# EAGLE design lamloei_app_a092508 (EAGLE 7.7.0)
CNAME: LamLoei A092508; CREVISION: R1; DESIGNER: lamloei co.,ltd.
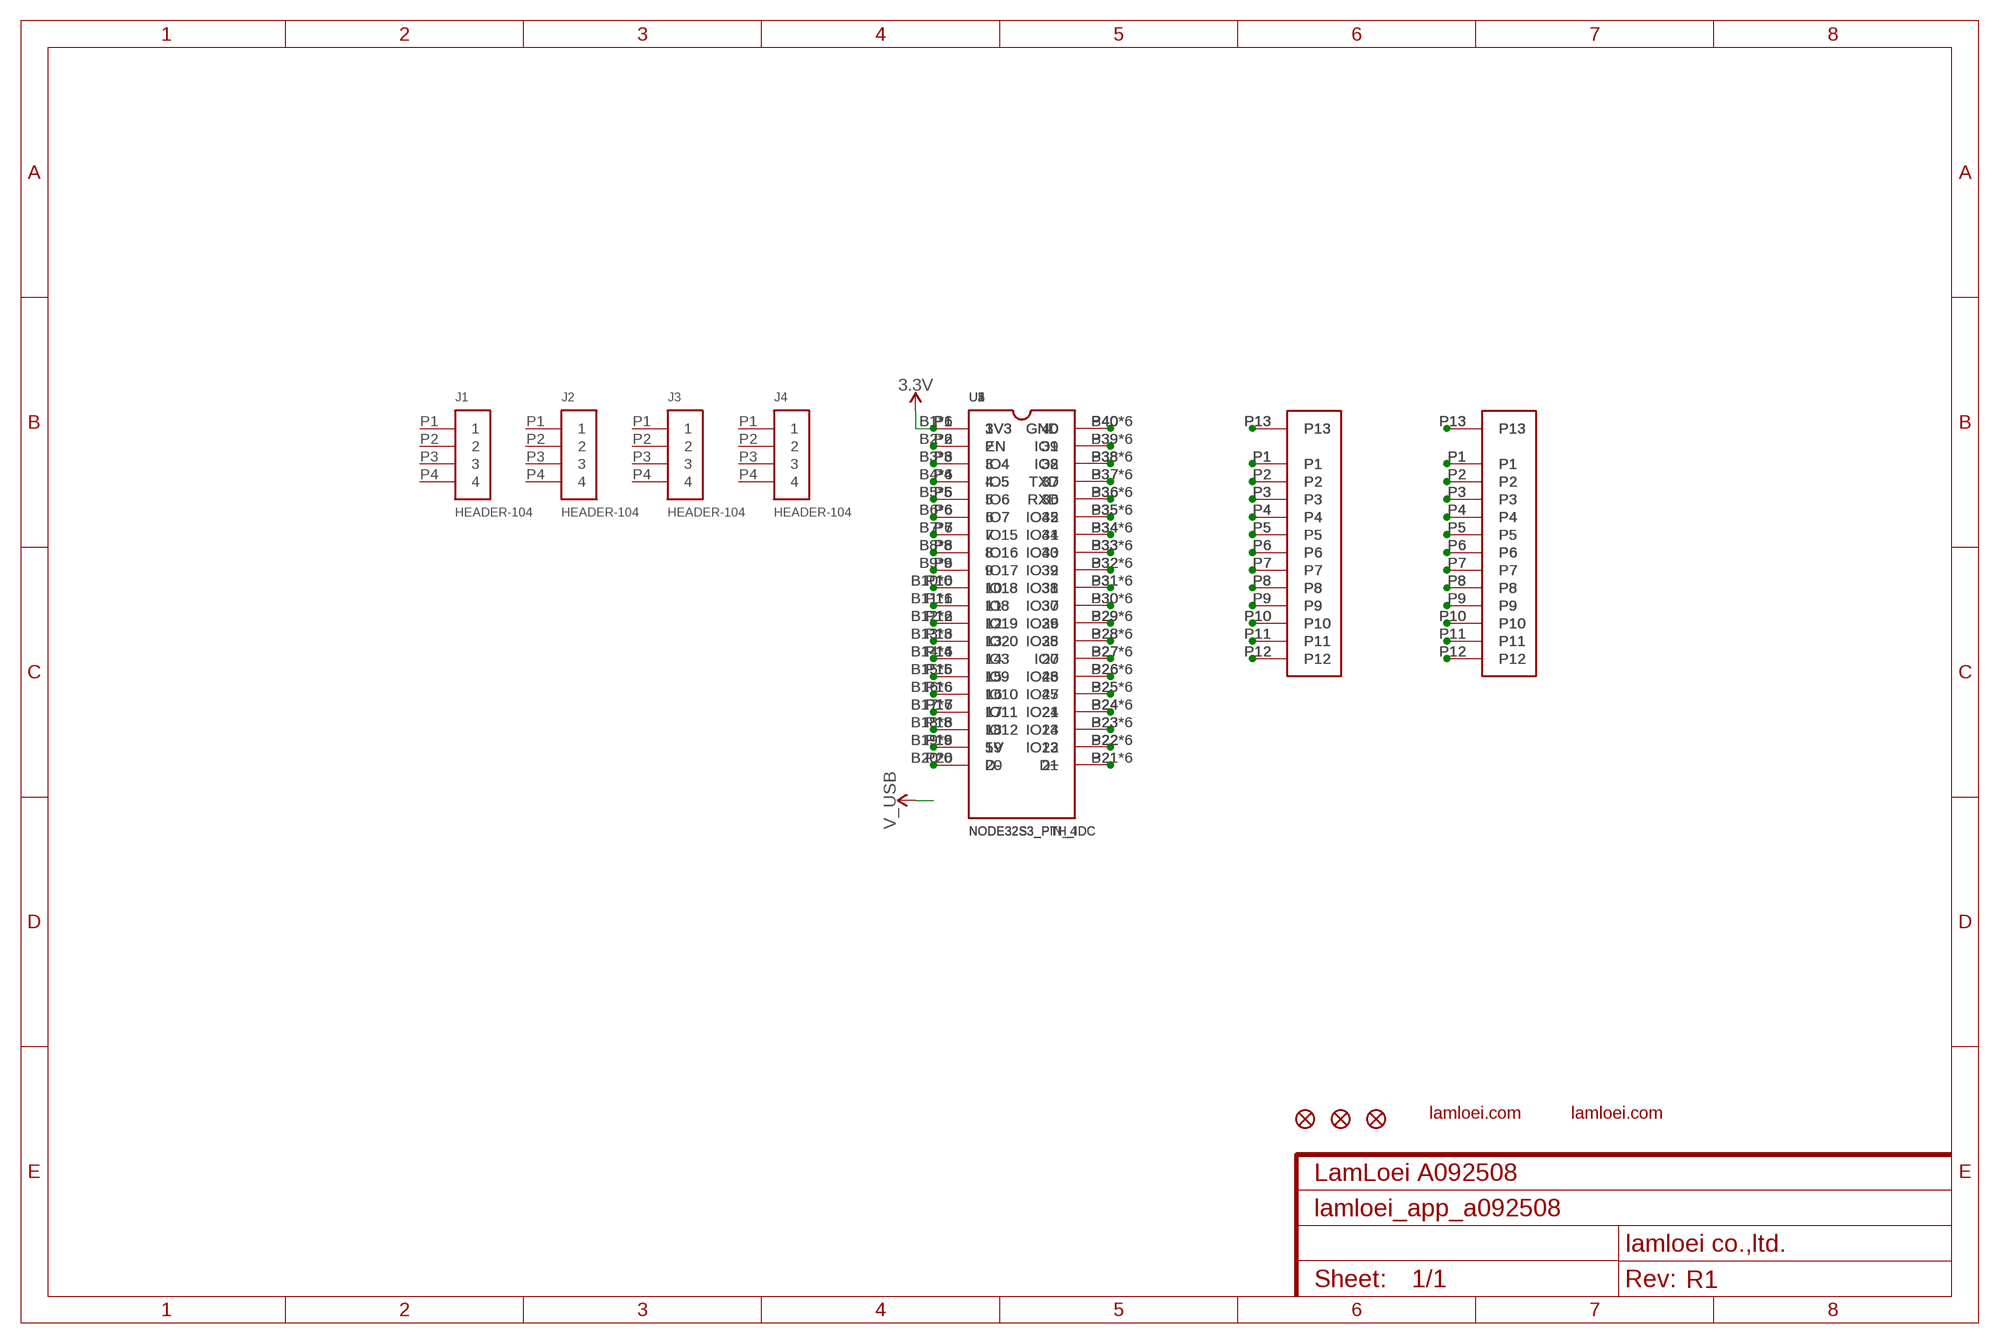
[diagram p0: schematic, sheet 1]

## Parts
J1  HEADER-104  [HEADER-104]
J2  HEADER-104  [HEADER-104]
J3  HEADER-104  [HEADER-104]
J4  HEADER-104  [HEADER-104]
U1  NODE32S3_PIN_4  [NODE32S3_PTH_4]
U2  NODE32S3_PIN_4  [NODE32S3_PTH_4]
U3  NODE32S3_PTH_IDC  [NODE32S3_PTH_IDC]
U4  NODE32S3_PTH_IDC  [NODE32S3_PTH_IDC]
U5  NODE32S3_PTH_IDC  [NODE32S3_PTH_IDC]
X1  5EHDRC-12P-508  [5EHDRC-12P-508]
X2  5EHDRC-12P-5.08MM  [5EHDRC-12P-5.08MM]
X3  5EHDRC-12P-2-508  [5EHDRC-12P-2-508]
X4  5EHDRC-12P-508  [5EHDRC-12P-508]
X5  5EHDRC-12P-5.08MM  [5EHDRC-12P-5.08MM]
X6  5EHDRC-12P-2-508  [5EHDRC-12P-2-508]
ZFD1  FIDUCIAL1X2  [FIDUCIAL-1X2]
ZFD2  FIDUCIAL1X2  [FIDUCIAL-1X2]
ZFD3  FIDUCIAL1X2  [FIDUCIAL-1X2]
ZL1  LAMLEOI_LOGO_3  [LAMLEOI_LOGO_3]
ZL2  LAMLEOI_LOGO_3  [LAMLEOI_LOGO_3]

## Nets
3.3V: U1.B1 U1.N1 U1.O1 U1.P1 U1.Q1 U1.T1 U2.B1 U2.N1 U2.O1 U2.P1 U2.Q1 U2.T1 U3.P1(3V3) U4.P1(3V3) U5.P1(3V3)
N$2: X1.P1 X2.P1 X3.P1
N$3: U1.B2 U1.N2 U1.O2 U1.P2 U1.Q2 U1.T2 U2.B2 U2.N2 U2.O2 U2.P2 U2.Q2 U2.T2 U3.P2(EN) U4.P2(EN) U5.P2(EN)
N$4: U1.B3 U1.N3 U1.O3 U1.P3 U1.Q3 U1.T3 U2.B3 U2.N3 U2.O3 U2.P3 U2.Q3 U2.T3 U3.P3(IO4) U4.P3(IO4) U5.P3(IO4)
N$5: U1.B4 U1.N4 U1.O4 U1.P4 U1.Q4 U1.T4 U2.B4 U2.N4 U2.O4 U2.P4 U2.Q4 U2.T4 U3.P4(IO5) U4.P4(IO5) U5.P4(IO5)
N$6: U1.B5 U1.N5 U1.O5 U1.P5 U1.Q5 U1.T5 U2.B5 U2.N5 U2.O5 U2.P5 U2.Q5 U2.T5 U3.P5(IO6) U4.P5(IO6) U5.P5(IO6)
N$7: U1.B6 U1.N6 U1.O6 U1.P6 U1.Q6 U1.T6 U2.B6 U2.N6 U2.O6 U2.P6 U2.Q6 U2.T6 U3.P6(IO7) U4.P6(IO7) U5.P6(IO7)
N$8: U1.B7 U1.N7 U1.O7 U1.P7 U1.Q7 U1.T7 U2.B7 U2.N7 U2.O7 U2.P7 U2.Q7 U2.T7 U3.P7(IO15) U4.P7(IO15) U5.P7(IO15)
N$9: U1.B8 U1.N8 U1.O8 U1.P8 U1.Q8 U1.T8 U2.B8 U2.N8 U2.O8 U2.P8 U2.Q8 U2.T8 U3.P8(IO16) U4.P8(IO16) U5.P8(IO16)
N$10: U1.B9 U1.N9 U1.O9 U1.P9 U1.Q9 U1.T9 U2.B9 U2.N9 U2.O9 U2.P9 U2.Q9 U2.T9 U3.P9(IO17) U4.P9(IO17) U5.P9(IO17)
N$11: U1.B10 U1.N10 U1.O10 U1.P10 U1.Q10 U1.T10 U2.B10 U2.N10 U2.O10 U2.P10 U2.Q10 U2.T10 U3.P10(IO18) U4.P10(IO18) U5.P10(IO18)
N$12: U1.B11 U1.N11 U1.O11 U1.P11 U1.Q11 U1.T11 U2.B11 U2.N11 U2.O11 U2.P11 U2.Q11 U2.T11 U3.P11(IO8) U4.P11(IO8) U5.P11(IO8)
N$13: U1.B12 U1.N12 U1.O12 U1.P12 U1.Q12 U1.T12 U2.B12 U2.N12 U2.O12 U2.P12 U2.Q12 U2.T12 U3.P12(IO19) U4.P12(IO19) U5.P12(IO19)
N$14: U1.B13 U1.N13 U1.O13 U1.P13 U1.Q13 U1.T13 U2.B13 U2.N13 U2.O13 U2.P13 U2.Q13 U2.T13 U3.P13(IO20) U4.P13(IO20) U5.P13(IO20)
N$15: U1.B14 U1.N14 U1.O14 U1.P14 U1.Q14 U1.T14 U2.B14 U2.N14 U2.O14 U2.P14 U2.Q14 U2.T14 U3.P14(IO3) U4.P14(IO3) U5.P14(IO3)
N$16: U1.B15 U1.N15 U1.O15 U1.P15 U1.Q15 U1.T15 U2.B15 U2.N15 U2.O15 U2.P15 U2.Q15 U2.T15 U3.P15(IO9) U4.P15(IO9) U5.P15(IO9)
N$17: U1.B17 U1.N17 U1.O17 U1.P17 U1.Q17 U1.T17 U2.B17 U2.N17 U2.O17 U2.P17 U2.Q17 U2.T17 U3.P17(IO11) U4.P17(IO11) U5.P17(IO11)
N$18: U1.B16 U1.N16 U1.O16 U1.P16 U1.Q16 U1.T16 U2.B16 U2.N16 U2.O16 U2.P16 U2.Q16 U2.T16 U3.P16(IO10) U4.P16(IO10) U5.P16(IO10)
N$19: U1.B18 U1.N18 U1.O18 U1.P18 U1.Q18 U1.T18 U2.B18 U2.N18 U2.O18 U2.P18 U2.Q18 U2.T18 U3.P18(IO12) U4.P18(IO12) U5.P18(IO12)
N$20: U1.B19 U1.N19 U1.O19 U1.P19 U1.Q19 U1.T19 U2.B19 U2.N19 U2.O19 U2.P19 U2.Q19 U2.T19 U3.P19(5V) U4.P19(5V) U5.P19(5V)
N$21: U1.B20 U1.N20 U1.O20 U1.P20 U1.Q20 U1.T20 U2.B20 U2.N20 U2.O20 U2.P20 U2.Q20 U2.T20 U3.P20(D-) U4.P20(D-) U5.P20(D-)
N$22: U1.B21 U1.N21 U1.O21 U1.P21 U1.Q21 U1.T21 U2.B21 U2.N21 U2.O21 U2.P21 U2.Q21 U2.T21 U3.P21(D+) U4.P21(D+) U5.P21(D+)
N$23: U1.B22 U1.N22 U1.O22 U1.P22 U1.Q22 U1.T22 U2.B22 U2.N22 U2.O22 U2.P22 U2.Q22 U2.T22 U3.P22(IO13) U4.P22(IO13) U5.P22(IO13)
N$24: U1.B23 U1.N23 U1.O23 U1.P23 U1.Q23 U1.T23 U2.B23 U2.N23 U2.O23 U2.P23 U2.Q23 U2.T23 U3.P23(IO14) U4.P23(IO14) U5.P23(IO14)
N$25: U1.B24 U1.N24 U1.O24 U1.P24 U1.Q24 U1.T24 U2.B24 U2.N24 U2.O24 U2.P24 U2.Q24 U2.T24 U3.P24(IO21) U4.P24(IO21) U5.P24(IO21)
N$26: U1.B25 U1.N25 U1.O25 U1.P25 U1.Q25 U1.T25 U2.B25 U2.N25 U2.O25 U2.P25 U2.Q25 U2.T25 U3.P25(IO47) U4.P25(IO47) U5.P25(IO47)
N$27: U1.B26 U1.N26 U1.O26 U1.P26 U1.Q26 U1.T26 U2.B26 U2.N26 U2.O26 U2.P26 U2.Q26 U2.T26 U3.P26(IO48) U4.P26(IO48) U5.P26(IO48)
N$28: U1.B27 U1.N27 U1.O27 U1.P27 U1.Q27 U1.T27 U2.B27 U2.N27 U2.O27 U2.P27 U2.Q27 U2.T27 U3.P27(IO0) U4.P27(IO0) U5.P27(IO0)
N$29: U1.B28 U1.N28 U1.O28 U1.P28 U1.Q28 U1.T28 U2.B28 U2.N28 U2.O28 U2.P28 U2.Q28 U2.T28 U3.P28(IO35) U4.P28(IO35) U5.P28(IO35)
N$30: U1.B29 U1.N29 U1.O29 U1.P29 U1.Q29 U1.T29 U2.B29 U2.N29 U2.O29 U2.P29 U2.Q29 U2.T29 U3.P29(IO36) U4.P29(IO36) U5.P29(IO36)
N$31: U1.B30 U1.N30 U1.O30 U1.P30 U1.Q30 U1.T30 U2.B30 U2.N30 U2.O30 U2.P30 U2.Q30 U2.T30 U3.P30(IO37) U4.P30(IO37) U5.P30(IO37)
N$32: U1.B31 U1.N31 U1.O31 U1.P31 U1.Q31 U1.T31 U2.B31 U2.N31 U2.O31 U2.P31 U2.Q31 U2.T31 U3.P31(IO38) U4.P31(IO38) U5.P31(IO38)
N$33: U1.B32 U1.N32 U1.O32 U1.P32 U1.Q32 U1.T32 U2.B32 U2.N32 U2.O32 U2.P32 U2.Q32 U2.T32 U3.P32(IO39) U4.P32(IO39) U5.P32(IO39)
N$34: U1.B33 U1.N33 U1.O33 U1.P33 U1.Q33 U1.T33 U2.B33 U2.N33 U2.O33 U2.P33 U2.Q33 U2.T33 U3.P33(IO40) U4.P33(IO40) U5.P33(IO40)
N$35: U1.B34 U1.N34 U1.O34 U1.P34 U1.Q34 U1.T34 U2.B34 U2.N34 U2.O34 U2.P34 U2.Q34 U2.T34 U3.P34(IO41) U4.P34(IO41) U5.P34(IO41)
N$36: U1.B35 U1.N35 U1.O35 U1.P35 U1.Q35 U1.T35 U2.B35 U2.N35 U2.O35 U2.P35 U2.Q35 U2.T35 U3.P35(IO42) U4.P35(IO42) U5.P35(IO42)
N$37: U1.B36 U1.N36 U1.O36 U1.P36 U1.Q36 U1.T36 U2.B36 U2.N36 U2.O36 U2.P36 U2.Q36 U2.T36 U3.P36(RXD) U4.P36(RXD) U5.P36(RXD)
N$38: U1.B37 U1.N37 U1.O37 U1.P37 U1.Q37 U1.T37 U2.B37 U2.N37 U2.O37 U2.P37 U2.Q37 U2.T37 U3.P37(TXD) U4.P37(TXD) U5.P37(TXD)
N$39: U1.B38 U1.N38 U1.O38 U1.P38 U1.Q38 U1.T38 U2.B38 U2.N38 U2.O38 U2.P38 U2.Q38 U2.T38 U3.P38(IO2) U4.P38(IO2) U5.P38(IO2)
N$40: U1.B39 U1.N39 U1.O39 U1.P39 U1.Q39 U1.T39 U2.B39 U2.N39 U2.O39 U2.P39 U2.Q39 U2.T39 U3.P39(IO1) U4.P39(IO1) U5.P39(IO1)
N$41: U1.B40 U1.N40 U1.O40 U1.P40 U1.Q40 U1.T40 U2.B40 U2.N40 U2.O40 U2.P40 U2.Q40 U2.T40 U3.P40(GND) U4.P40(GND) U5.P40(GND)
N$42: X1.P2 X2.P2 X3.P2
N$43: X1.P3 X2.P3 X3.P3
N$44: X1.P4 X2.P4 X3.P4
N$45: X1.P5 X2.P5 X3.P5
N$46: X1.P6 X2.P6 X3.P6
N$47: X1.P7 X2.P7 X3.P7
N$48: X1.P8 X2.P8 X3.P8
N$49: X1.P9 X2.P9 X3.P9
N$50: X1.P10 X2.P10 X3.P10
N$51: X1.P11 X2.P11 X3.P11
N$52: X1.P12 X2.P12 X3.P12
N$53: X1.P13 X2.P13 X3.P13
N$54: X4.P1 X5.P1 X6.P1
N$55: X4.P2 X5.P2 X6.P2
N$56: X4.P3 X5.P3 X6.P3
N$57: X4.P4 X5.P4 X6.P4
N$58: X4.P5 X5.P5 X6.P5
N$59: X4.P6 X5.P6 X6.P6
N$60: X4.P7 X5.P7 X6.P7
N$61: X4.P8 X5.P8 X6.P8
N$62: X4.P9 X5.P9 X6.P9
N$63: X4.P10 X5.P10 X6.P10
N$64: X4.P11 X5.P11 X6.P11
N$65: X4.P12 X5.P12 X6.P12
N$66: X4.P13 X5.P13 X6.P13
Unconnected: J1.P1 J1.P2 J1.P3 J1.P4 J2.P1 J2.P2 J2.P3 J2.P4 J3.P1 J3.P2 J3.P3 J3.P4 J4.P1 J4.P2 J4.P3 J4.P4

## Library data of the parts
J1-J4 = lamloei_e77_HEADER-104A:HEADER-104
U1 U2 = lamloei_e77_node32s3:NODE32S3_PIN_4
U3-U5 = lamloei_e77_node32s3:NODE32S3_PTH_IDC
X1 X4 = lamloei_e77_5EHDRC-12P:5EHDRC-12P-508
X2 X5 = lamloei_e77_5EHDRC-12P:5EHDRC-12P-5.08MM
X3 X6 = lamloei_e77_5EHDRC-12P:5EHDRC-12P-2-508
ZFD1-ZFD3 = SparkFun-Aesthetics:FIDUCIAL: Fiducial Alignment Points Point-of-reference for pick-and-place machines and other optical instruments.
ZL1 ZL2 = lamloei_logo_3:LAMLEOI_LOGO_3: lamloei

## Board
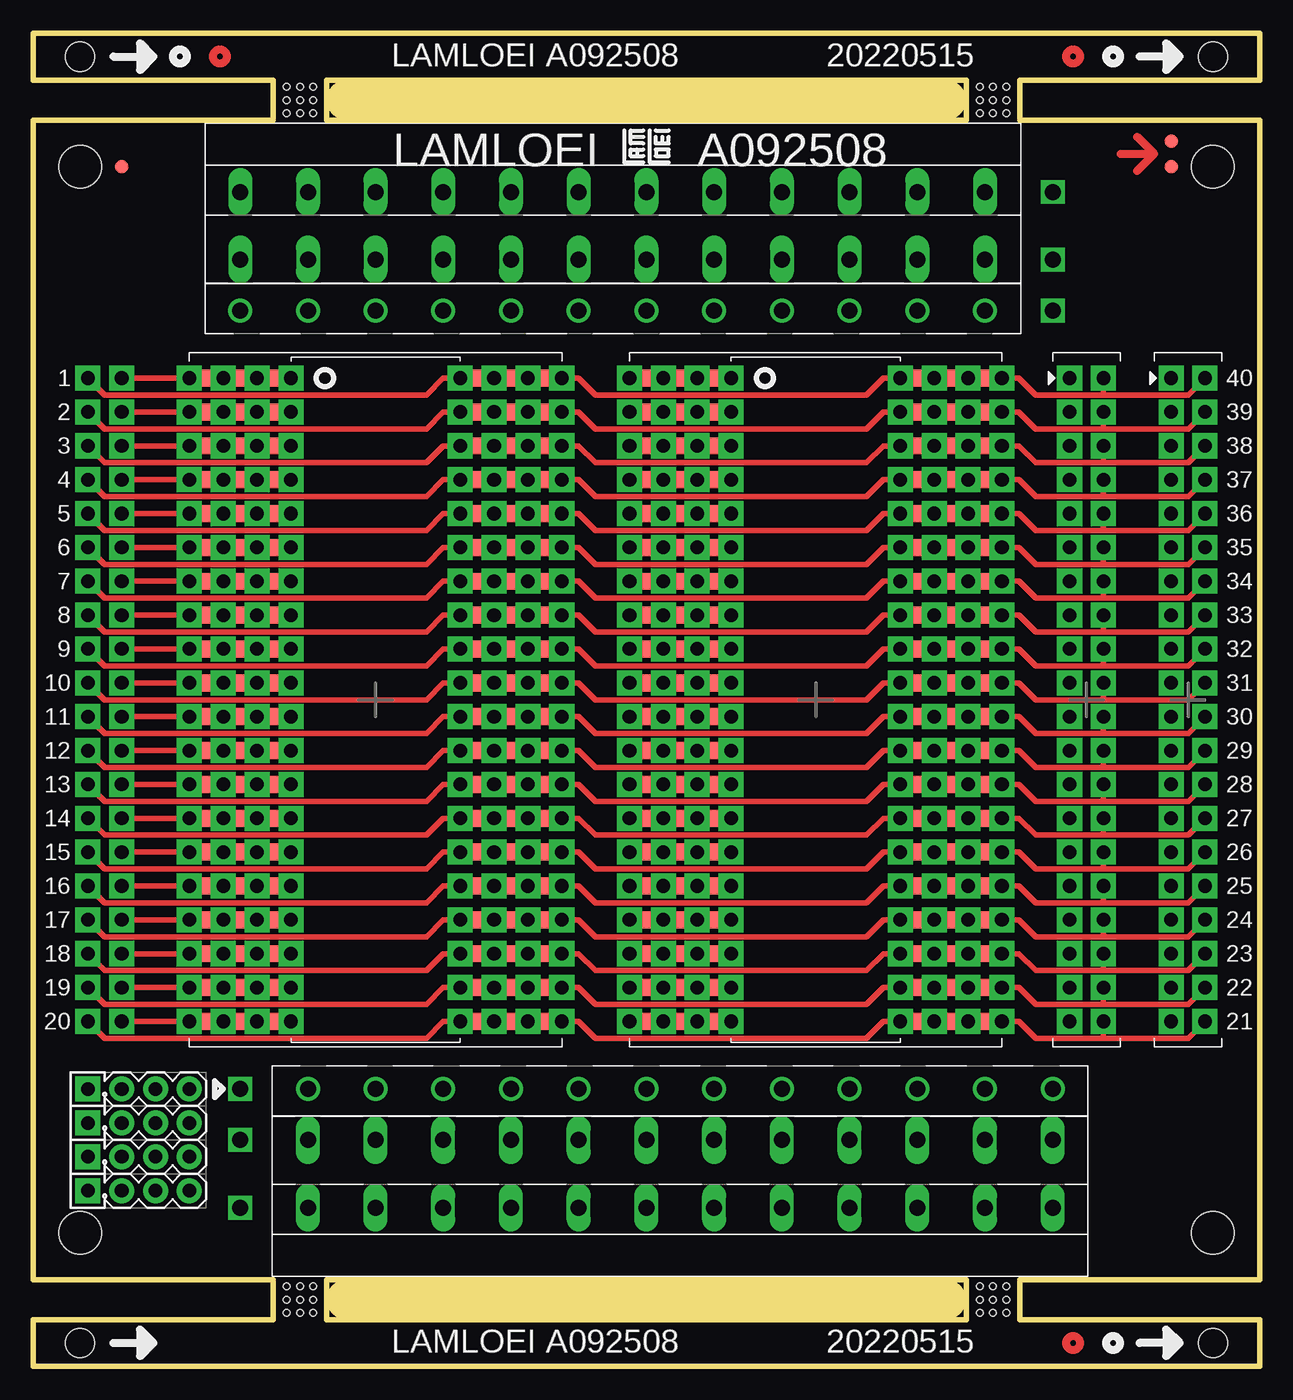
[diagram p1: board, top side]
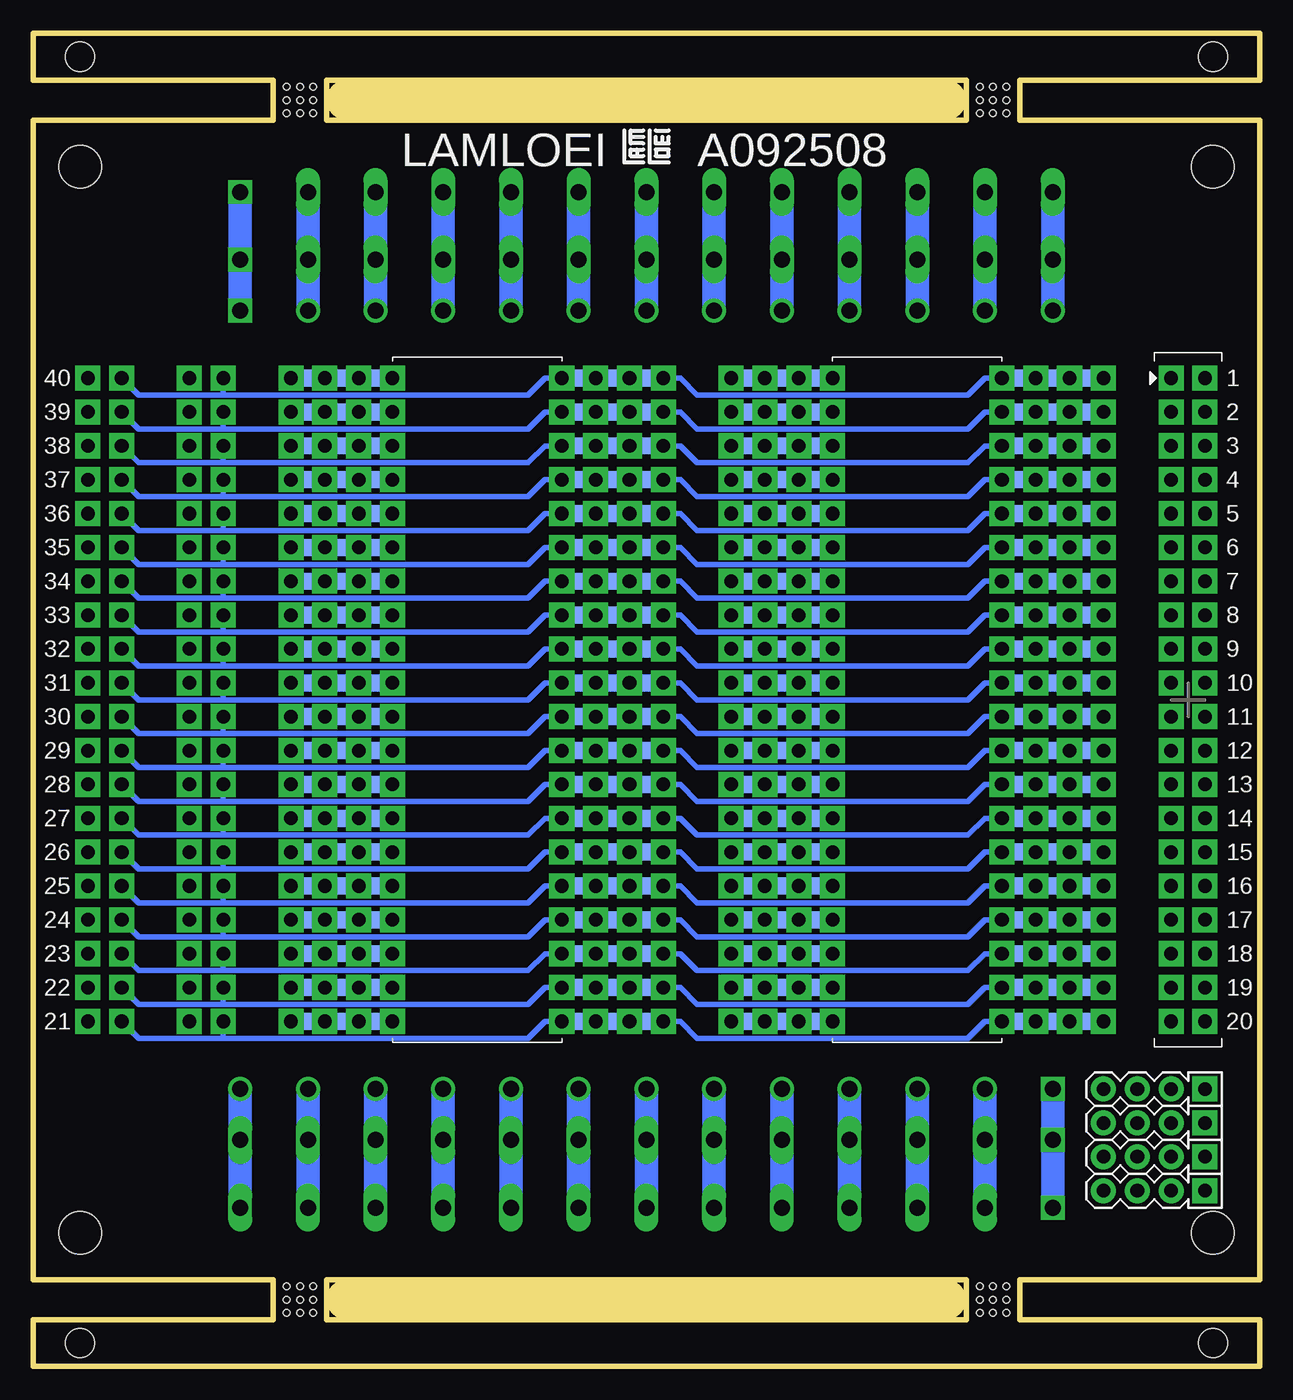
[diagram p2: board, bottom side, seen from below]

Size 92 x 100 mm. Coordinates in mm from the lower left corner, seen from the top.
Outline: 0,93.5 18,93.5 18,96.5 0,96.5 0,100 92,100 92,96.5 74,96.5 74,93.5 92,93.5 92,6.5 74,6.5 74,3.5 92,3.5 92,0 0,0 0,3.5 18,3.5 18,6.5 0,6.5 0,93.5
Outline: 22,93.5 70,93.5 70,96.5 22,96.5 22,93.5
Outline: 70,6.5 22,6.5 22,3.5 70,3.5 70,6.5
Copper layers (1*16): Top 0.035mm / dielectric 0.2mm / Bottom 0.035mm
Design rules "jlcpcb-2-layer": minimum track width 3.5mil, minimum drill 0.2mm, track to track 3.5mil, track to pad 5mil, pad to pad 5mil, via to via 5mil, smd to smd 0mil, copper to edge 0.1mm, drill to drill 5mil, minimum pad ring 4mil, minimum via ring 4mil, stop-mask expansion 3mil, vias tented up to drill 100mil, thermal gap 10mil
Holes 3.2 mm at 3.5,10 88.5,10 3.5,90 88.5,90
Holes 0.5 mm at 20,94 21,94 19,94 19,95 19,96 20,96 20,95 21,95 21,96 72,94 71,94 71,95 71,96 72,96 72,95 73,95 73,94 73,96 20,6 19,6 19,5 19,4 20,4 20,5 21,6 21,5 21,4 72,6 71,6 71,5 71,4 72,5 72,4 73,4 73,5 73,6
Holes 2.2 mm at 3.5,1.75 88.5,1.75 3.5,98.25 88.5,98.25
Milling: 2 lines

### Footprints (pad centres in the part's own frame; a part is rotated, then mirrored left to right if it is on the bottom)
HEADER-104 = drill 1.016 pad 1.88 square: P1 3.81,0 | drill 1.016 pad 1.88: P2 1.27,0; P3 -1.27,0; P4 -3.81,0
NODE32S3_PTH_4 = smd 8.89 x 1.27 bottom: B1 3.175,50.165; B2 3.175,47.625; B3 3.175,45.085; B4 3.175,42.545; B5 3.175,40.005; B6 3.175,37.465; B7 3.175,34.925; B8 3.175,32.385; B9 3.175,29.845; B10 3.175,27.305; B11 3.175,24.765; B12 3.175,22.225; B13 3.175,19.685; B14 3.175,17.145; B15 3.175,14.605; B16 3.175,12.065; B17 3.175,9.525; B18 3.175,6.985; B19 3.175,4.445; B20 3.175,1.905; B21 23.495,1.905; B22 23.495,4.445; B23 23.495,6.985; B24 23.495,9.525; B25 23.495,12.065; B26 23.495,14.605; B27 23.495,17.145; B28 23.495,19.685; B29 23.495,22.225; B30 23.495,24.765; B31 23.495,27.305; B32 23.495,29.845; B33 23.495,32.385; B34 23.495,34.925; B35 23.495,37.465; B36 23.495,40.005; B37 23.495,42.545; B38 23.495,45.085; B39 23.495,47.625; B40 23.495,50.165 | drill 1.016 pad 1.88 square: N1 6.985,50.165; N2 6.985,47.625; N3 6.985,45.085; N4 6.985,42.545; N5 6.985,40.005; N6 6.985,37.465; N7 6.985,34.925; N8 6.985,32.385; N9 6.985,29.845; N10 6.985,27.305; N11 6.985,24.765; N12 6.985,22.225; N13 6.985,19.685; N14 6.985,17.145; N15 6.985,14.605; N16 6.985,12.065; N17 6.985,9.525; N18 6.985,6.985; N19 6.985,4.445; N20 6.985,1.905; N21 19.685,1.905; N22 19.685,4.445; N23 19.685,6.985; N24 19.685,9.525; N25 19.685,12.065; N26 19.685,14.605; N27 19.685,17.145; N28 19.685,19.685; N29 19.685,22.225; N30 19.685,24.765; N31 19.685,27.305; N32 19.685,29.845; N33 19.685,32.385; N34 19.685,34.925; N35 19.685,37.465; N36 19.685,40.005; N37 19.685,42.545; N38 19.685,45.085; N39 19.685,47.625; N40 19.685,50.165; O1 4.445,50.165; O2 4.445,47.625; O3 4.445,45.085; O4 4.445,42.545; O5 4.445,40.005; O6 4.445,37.465; O7 4.445,34.925; O8 4.445,32.385; O9 4.445,29.845; O10 4.445,27.305; O11 4.445,24.765; O12 4.445,22.225; O13 4.445,19.685; O14 4.445,17.145; O15 4.445,14.605; O16 4.445,12.065; O17 4.445,9.525; O18 4.445,6.985; O19 4.445,4.445; O20 4.445,1.905; O21 22.225,1.905; O22 22.225,4.445; O23 22.225,6.985; O24 22.225,9.525; O25 22.225,12.065; O26 22.225,14.605; O27 22.225,17.145; O28 22.225,19.685; O29 22.225,22.225; O30 22.225,24.765; O31 22.225,27.305; O32 22.225,29.845; O33 22.225,32.385; O34 22.225,34.925; O35 22.225,37.465; O36 22.225,40.005; O37 22.225,42.545; O38 22.225,45.085; O39 22.225,47.625; O40 22.225,50.165; P1 1.905,50.165; P2 1.905,47.625; P3 1.905,45.085; P4 1.905,42.545; P5 1.905,40.005; P6 1.905,37.465; P7 1.905,34.925; P8 1.905,32.385; P9 1.905,29.845; P10 1.905,27.305; P11 1.905,24.765; P12 1.905,22.225; P13 1.905,19.685; P14 1.905,17.145; P15 1.905,14.605; P16 1.905,12.065; P17 1.905,9.525; P18 1.905,6.985; P19 1.905,4.445; P20 1.905,1.905; P21 24.765,1.905; P22 24.765,4.445; P23 24.765,6.985; P24 24.765,9.525; P25 24.765,12.065; P26 24.765,14.605; P27 24.765,17.145; P28 24.765,19.685; P29 24.765,22.225; P30 24.765,24.765; P31 24.765,27.305; P32 24.765,29.845; P33 24.765,32.385; P34 24.765,34.925; P35 24.765,37.465; P36 24.765,40.005; P37 24.765,42.545; P38 24.765,45.085; P39 24.765,47.625; P40 24.765,50.165; Q1 -0.635,50.165; Q2 -0.635,47.625; Q3 -0.635,45.085; Q4 -0.635,42.545; Q5 -0.635,40.005; Q6 -0.635,37.465; Q7 -0.635,34.925; Q8 -0.635,32.385; Q9 -0.635,29.845; Q10 -0.635,27.305; Q11 -0.635,24.765; Q12 -0.635,22.225; Q13 -0.635,19.685; Q14 -0.635,17.145; Q15 -0.635,14.605; Q16 -0.635,12.065; Q17 -0.635,9.525; Q18 -0.635,6.985; Q19 -0.635,4.445; Q20 -0.635,1.905; Q21 27.305,1.905; Q22 27.305,4.445; Q23 27.305,6.985; Q24 27.305,9.525; Q25 27.305,12.065; Q26 27.305,14.605; Q27 27.305,17.145; Q28 27.305,19.685; Q29 27.305,22.225; Q30 27.305,24.765; Q31 27.305,27.305; Q32 27.305,29.845; Q33 27.305,32.385; Q34 27.305,34.925; Q35 27.305,37.465; Q36 27.305,40.005; Q37 27.305,42.545; Q38 27.305,45.085; Q39 27.305,47.625; Q40 27.305,50.165 | smd 8.89 x 1.27: T1 3.175,50.165; T2 3.175,47.625; T3 3.175,45.085; T4 3.175,42.545; T5 3.175,40.005; T6 3.175,37.465; T7 3.175,34.925; T8 3.175,32.385; T9 3.175,29.845; T10 3.175,27.305; T11 3.175,24.765; T12 3.175,22.225; T13 3.175,19.685; T14 3.175,17.145; T15 3.175,14.605; T16 3.175,12.065; T17 3.175,9.525; T18 3.175,6.985; T19 3.175,4.445; T20 3.175,1.905; T21 23.495,1.905; T22 23.495,4.445; T23 23.495,6.985; T24 23.495,9.525; T25 23.495,12.065; T26 23.495,14.605; T27 23.495,17.145; T28 23.495,19.685; T29 23.495,22.225; T30 23.495,24.765; T31 23.495,27.305; T32 23.495,29.845; T33 23.495,32.385; T34 23.495,34.925; T35 23.495,37.465; T36 23.495,40.005; T37 23.495,42.545; T38 23.495,45.085; T39 23.495,47.625; T40 23.495,50.165
NODE32S3_PTH_IDC = drill 1.016 pad 1.88 square: P1 -1.27,24.13; P2 -1.27,21.59; P3 -1.27,19.05; P4 -1.27,16.51; P5 -1.27,13.97; P6 -1.27,11.43; P7 -1.27,8.89; P8 -1.27,6.35; P9 -1.27,3.81; P10 -1.27,1.27; P11 -1.27,-1.27; P12 -1.27,-3.81; P13 -1.27,-6.35; P14 -1.27,-8.89; P15 -1.27,-11.43; P16 -1.27,-13.97; P17 -1.27,-16.51; P18 -1.27,-19.05; P19 -1.27,-21.59; P20 -1.27,-24.13; P21 1.27,-24.13; P22 1.27,-21.59; P23 1.27,-19.05; P24 1.27,-16.51; P25 1.27,-13.97; P26 1.27,-11.43; P27 1.27,-8.89; P28 1.27,-6.35; P29 1.27,-3.81; P30 1.27,-1.27; P31 1.27,1.27; P32 1.27,3.81; P33 1.27,6.35; P34 1.27,8.89; P35 1.27,11.43; P36 1.27,13.97; P37 1.27,16.51; P38 1.27,19.05; P39 1.27,21.59; P40 1.27,24.13
5EHDRC-12P-508 = drill 1.2 long: P1 -25.4,0; P2 -20.32,0; P3 -15.24,0; P4 -10.16,0; P5 -5.08,0; P6 0,0; P7 5.08,0; P8 10.16,0; P9 15.24,0; P10 20.32,0; P11 25.4,0; P12 30.48,0 | drill 1.2 square: P13 -30.48,0
5EHDRC-12P-5.08MM = drill 1.2: P1 -25.4,0; P2 -20.32,0; P3 -15.24,0; P4 -10.16,0; P5 -5.08,0; P6 0,0; P7 5.08,0; P8 10.16,0; P9 15.24,0; P10 20.32,0; P11 25.4,0; P12 30.48,0 | drill 1.2 square: P13 -30.48,0
5EHDRC-12P-2-508 = drill 1.2 long: P1 -25.4,0; P2 -20.32,0; P3 -15.24,0; P4 -10.16,0; P5 -5.08,0; P6 0,0; P7 5.08,0; P8 10.16,0; P9 15.24,0; P10 20.32,0; P11 25.4,0; P12 30.48,0 | drill 1.2 square: P13 -30.48,0
FIDUCIAL-1X2 = smd 1 x 1: 1 0,0

### Placement (x,y rotation side)
J1  7.9,20.79 180 top
J2  7.9,18.25 180 top
J3  7.9,15.71 180 top
J4  7.9,13.17 180 top
U1  45.37,23.96 0 top
U2  12.34,23.96 0 top
U3  79.02,50 0 top
U4  86.64,50 0 top
U5  5.36,50 0 bottom
X1  46,16.98 0 top
X2  46,20.79 0 top
X3  46,11.9 0 top
X4  46,83.02 180 top
X5  46,79.21 180 top
X6  46,88.1 180 top
ZFD1  6.63,90 0 top
ZFD2  85.37,91.91 0 top
ZFD3  85.37,90 0 top
ZL1  44.02,90 0 top
ZL2  47.98,90 0 bottom

### Tracks (layer width: path | path; a pad name or v marks a point on that pad's centre or on a via)
3.3V
  Top 0.406: U5.P1 U2.Q1 U2.P1 | U2.N1 U2.O1 U2.T1 | U1.Q1 U1.P1 U1.T1 U1.O1 U1.N1
  Bottom 0.406: 77.75,72.86 54.89,72.86 53.62,74.13 U1.N1 | 77.75,72.86 84.1,72.86 U4.P1 | U3.P1 77.75,72.86 | U2.P1 U2.T1 U2.O1 | U2.N1 20.6,74.13 21.87,72.86 42.19,72.86 43.46,74.13 U1.Q1 | U1.T1 U1.P1
N$1
  Top 0.61: 81.56,90.96 84.1,90.96 | 84.1,90.96 82.83,92.23 | 82.83,89.69 84.1,90.96
N$2
  Bottom 1.778: X3.P1 X1.P1 X2.P1
N$3
  Top 0.406: U5.P2 U2.Q2 U2.P2 | U2.N2 U2.O2 U2.T2 | U1.N2 U1.O2 U1.T2 U1.P2 U1.Q2
  Bottom 0.406: 77.75,70.32 54.89,70.32 53.62,71.59 U1.N2 | 77.75,70.32 84.1,70.32 U4.P2 | U3.P2 77.75,70.32 | U2.P2 U2.T2 U2.O2 | U2.N2 20.6,71.59 21.87,70.32 42.19,70.32 43.46,71.59 U1.Q2 | U1.T2 U1.P2
N$4
  Top 0.406: U5.P3 U2.Q3 U2.P3 | U2.N3 U2.O3 U2.T3 | U1.Q3 U1.P3 U1.T3 U1.O3 U1.N3
  Bottom 0.406: 77.75,67.78 54.89,67.78 53.62,69.05 U1.N3 | 77.75,67.78 84.1,67.78 U4.P3 | U3.P3 77.75,67.78 | U2.P3 U2.T3 U2.O3 | U2.N3 20.6,69.05 21.87,67.78 42.19,67.78 43.46,69.05 U1.Q3 | U1.T3 U1.P3
N$5
  Top 0.406: U5.P4 U2.Q4 U2.P4 | U2.N4 18.06,66.51 U2.O4 U2.B4 | U1.N4 U1.O4 | U1.O4 U1.B4 | U1.O4 U1.B4 | U1.B4 U1.P4 U1.Q4
  Bottom 0.406: 77.75,65.24 54.89,65.24 53.62,66.51 U1.N4 | 77.75,65.24 84.1,65.24 U4.P4 | U3.P4 77.75,65.24 | U2.P4 U2.B4 U2.O4 | U2.N4 20.6,66.51 21.87,65.24 42.19,65.24 43.46,66.51 U1.Q4 | U1.B4 U1.P4
N$6
  Top 0.406: U5.P5 U2.Q5 U2.P5 | U2.N5 U2.O5 U2.B5 | U1.Q5 U1.P5 U1.B5 U1.O5 U1.N5
  Bottom 0.406: 77.75,62.7 54.89,62.7 53.62,63.97 U1.N5 | 77.75,62.7 84.1,62.7 U4.P5 | U3.P5 77.75,62.7 | U2.P5 U2.B5 U2.O5 | U2.N5 20.6,63.97 21.87,62.7 42.19,62.7 43.46,63.97 U1.Q5 | U1.B5 U1.P5
N$7
  Top 0.406: U5.P6 U2.Q6 U2.P6 | U2.N6 U2.O6 U2.B6 | U1.N6 U1.O6 U1.B6 U1.P6 U1.Q6
  Bottom 0.406: 77.75,60.16 54.89,60.16 53.62,61.43 U1.N6 | 77.75,60.16 84.1,60.16 U4.P6 | U3.P6 77.75,60.16 | U2.P6 U2.B6 U2.O6 | U2.N6 20.6,61.43 21.87,60.16 42.19,60.16 43.46,61.43 U1.Q6 | U1.B6 U1.P6
N$8
  Top 0.406: U5.P7 U2.Q7 U2.P7 | U2.N7 U2.O7 U2.B7 | U1.Q7 U1.P7 U1.B7 U1.O7 U1.N7
  Bottom 0.406: 77.75,57.62 54.89,57.62 53.62,58.89 U1.N7 | 77.75,57.62 84.1,57.62 U4.P7 | U3.P7 77.75,57.62 | U2.P7 U2.B7 U2.O7 | U2.N7 20.6,58.89 21.87,57.62 42.19,57.62 43.46,58.89 U1.Q7 | U1.B7 U1.P7
N$9
  Top 0.406: U5.P8 U2.Q8 U2.P8 | U2.N8 U2.O8 U2.T8 | U1.N8 U1.O8 U1.T8 U1.P8 U1.Q8
  Bottom 0.406: 77.75,55.08 54.89,55.08 53.62,56.35 U1.N8 | 77.75,55.08 84.1,55.08 U4.P8 | U3.P8 77.75,55.08 | U2.P8 U2.T8 U2.O8 | U2.N8 20.6,56.35 21.87,55.08 42.19,55.08 43.46,56.35 U1.Q8 | U1.T8 U1.P8
N$10
  Top 0.406: U5.P9 U2.Q9 U2.P9 | U2.N9 U2.O9 U2.T9 | U1.Q9 U1.P9 U1.T9 U1.O9 U1.N9
  Bottom 0.406: 77.75,52.54 54.89,52.54 53.62,53.81 U1.N9 | 77.75,52.54 84.1,52.54 U4.P9 | U3.P9 77.75,52.54 | U2.P9 U2.T9 U2.O9 | U2.N9 20.6,53.81 21.87,52.54 42.19,52.54 43.46,53.81 U1.Q9 | U1.T9 U1.P9
N$11
  Top 0.406: U5.P10 U2.Q10 U2.P10 | U2.N10 U2.O10 U2.B10 | U1.N10 U1.O10 U1.B10 U1.P10 U1.Q10
  Bottom 0.406: 77.75,50 54.89,50 53.62,51.27 U1.N10 | 77.75,50 84.1,50 U4.P10 | U3.P10 77.75,50 | U2.P10 U2.B10 U2.O10 | U2.N10 20.6,51.27 21.87,50 42.19,50 43.46,51.27 U1.Q10 | U1.B10 U1.P10
N$12
  Top 0.406: U5.P11 U2.Q11 U2.P11 | U2.N11 U2.O11 U2.B11 | U1.N11 51.08,48.73 U1.O11 U1.B11 U1.P11 U1.Q11
  Bottom 0.406: 77.75,47.46 54.89,47.46 53.62,48.73 U1.N11 | 77.75,47.46 84.1,47.46 U4.P11 | U3.P11 77.75,47.46 | U2.P11 U2.B11 | U2.N11 20.6,48.73 21.87,47.46 42.19,47.46 43.46,48.73 U1.Q11 | U2.B11 U2.P11 | U2.P11 U2.B11 | U1.B11 U1.P11 | U2.B11 U2.O11
N$13
  Top 0.406: U5.P12 U2.Q12 U2.P12 | U2.N12 U2.O12 U2.T12 | U1.Q12 U1.P12 U1.T12 U1.O12 U1.N12
  Bottom 0.406: 77.75,44.92 54.89,44.92 53.62,46.19 U1.N12 | 77.75,44.92 84.1,44.92 U4.P12 | U3.P12 77.75,44.92 | U2.P12 U2.T12 | U2.N12 20.6,46.19 21.87,44.92 42.19,44.92 43.46,46.19 U1.Q12 | U2.T12 U2.P12 | U2.P12 U2.T12 | U1.T12 U1.P12 | U2.T12 U2.O12
N$14
  Top 0.406: U5.P13 U2.Q13 U2.P13 | U2.N13 U2.O13 U2.T13 | U1.N13 U1.O13 U1.T13 U1.P13 U1.Q13
  Bottom 0.406: 77.75,42.38 54.89,42.38 53.62,43.65 U1.N13 | 77.75,42.38 84.1,42.38 U4.P13 | U3.P13 77.75,42.38 | U2.P13 U2.T13 | U2.N13 20.6,43.65 21.87,42.38 42.19,42.38 43.46,43.65 U1.Q13 | U2.T13 U2.P13 | U2.P13 U2.T13 | U1.T13 U1.P13 | U2.T13 U2.O13
N$15
  Top 0.406: U5.P14 U2.Q14 U2.P14 | U2.N14 U2.O14 U2.B14 | U1.Q14 46,41.11 | 46,41.11 U1.P14 | U1.P14 U1.B14 U1.O14 U1.N14 | U1.P14 46,41.11
  Bottom 0.406: 77.75,39.84 54.89,39.84 53.62,41.11 U1.N14 | 77.75,39.84 84.1,39.84 U4.P14 | U3.P14 77.75,39.84 | U2.P14 U2.B14 | U2.N14 20.6,41.11 21.87,39.84 42.19,39.84 43.46,41.11 U1.Q14 | U2.B14 U2.P14 | U2.P14 U2.B14 | U1.B14 U1.P14 | U2.B14 U2.O14
N$16
  Top 0.406: U5.P15 U2.Q15 U2.P15 | U2.N15 U2.O15 U2.B15 | U1.Q15 U1.P15 U1.B15 U1.O15 U1.N15
  Bottom 0.406: 77.75,37.3 54.89,37.3 53.62,38.57 U1.N15 | 77.75,37.3 84.1,37.3 U4.P15 | U3.P15 77.75,37.3 | U2.P15 U2.B15 | U2.N15 20.6,38.57 21.87,37.3 42.19,37.3 43.46,38.57 U1.Q15 | U2.B15 U2.P15 | U2.P15 U2.B15 | U1.B15 U1.P15 | U2.B15 U2.O15
N$17
  Top 0.406: U5.P17 U2.Q17 U2.P17 | U2.T17 U2.O17 U2.N17 | U1.N17 51.08,33.49 U1.O17 U1.T17 U1.P17 U1.Q17
  Bottom 0.406: 77.75,32.22 54.89,32.22 53.62,33.49 U1.N17 | 77.75,32.22 84.1,32.22 U4.P17 | U3.P17 77.75,32.22 | U2.P17 U2.T17 | U2.N17 20.6,33.49 21.87,32.22 42.19,32.22 43.46,33.49 U1.Q17 | U2.T17 U2.P17 | U2.P17 U2.T17 | U1.T17 U1.P17 | U2.T17 U2.O17
N$18
  Top 0.406: U5.P16 U2.Q16 U2.P16 | U2.N16 18.06,36.03 U2.O16 U2.B16 | U1.Q16 U1.P16 U1.B16 U1.O16 U1.N16
  Bottom 0.406: 77.75,34.76 54.89,34.76 53.62,36.03 U1.N16 | 77.75,34.76 84.1,34.76 U4.P16 | U3.P16 77.75,34.76 | U2.P16 U2.B16 | U2.N16 20.6,36.03 21.87,34.76 42.19,34.76 43.46,36.03 U1.Q16 | U2.B16 U2.P16 | U2.P16 U2.B16 | U1.B16 U1.P16 | U2.B16 U2.O16
N$19
  Top 0.406: U5.P18 U2.Q18 U2.P18 | U2.N18 U2.O18 U2.T18 | U1.Q18 U1.P18 U1.T18 U1.O18 U1.N18
  Bottom 0.406: 77.75,29.68 54.89,29.68 53.62,30.95 U1.N18 | 77.75,29.68 84.1,29.68 U4.P18 | U3.P18 77.75,29.68 | U2.P18 U2.T18 | U2.N18 20.6,30.95 21.87,29.68 42.19,29.68 43.46,30.95 U1.Q18 | U2.T18 U2.P18 | U2.P18 U2.T18 | U1.T18 U1.P18 | U2.T18 U2.P18 | U2.P18 U2.T18
N$20
  Top 0.406: U5.P19 U2.Q19 U2.P19 U2.T19 U2.O19 18.06,28.41 U2.N19 | U1.N19 U1.O19 U1.T19 U1.P19 U1.Q19
  Bottom 0.406: 77.75,27.14 54.89,27.14 53.62,28.41 U1.N19 | 77.75,27.14 84.1,27.14 U4.P19 | U3.P19 77.75,27.14 | U2.T19 U2.P19 | U2.N19 20.6,28.41 21.87,27.14 42.19,27.14 43.46,28.41 U1.Q19 | U1.T19 U1.P19
N$21
  Top 0.406: U5.P20 U2.Q20 U2.P20 | U1.T20 U1.P20 U1.Q20 | U1.O20 51.08,25.87 | U2.T20 U2.P20 | U2.P20 U2.T20 | U2.O20 U2.T20
  Bottom 0.406: 77.75,24.6 54.89,24.6 53.62,25.87 U1.N20 51.08,25.87 U1.O20 | 77.75,24.6 84.1,24.6 U4.P20 | U3.P20 77.75,24.6 | U2.P20 U2.T20 | U2.T20 U2.O20 | U2.O20 U2.N20 20.6,25.87 21.87,24.6 42.19,24.6 43.46,25.87 U1.Q20 | U1.T20 U1.O20 | U1.O20 U1.T20 | U1.T20 U1.O20 | U1.O20 U1.T20 | U2.T20 U2.O20 | U1.T20 U1.O20 | U1.O20 U1.T20
N$22
  Top 0.406: 73.94,25.87 75.21,24.6 80.29,24.6 | 80.29,24.6 86.64,24.6 U4.P21 | U3.P21 80.29,24.6 | U1.T21 U1.O21 66.32,25.87 U1.N21 63.78,25.87 62.51,24.6 42.19,24.6 40.92,25.87 U2.Q21 U2.P21 U2.T21 U2.O21 33.3,25.87 U2.N21 30.76,25.87 29.49,24.6 5.36,24.6 U5.P21 | U1.T21 U1.P21 | U1.P21 U1.Q21 | U1.Q21 73.94,25.87 | U1.Q21 73.94,25.87 | U1.T21 U1.P21
  Bottom 0.406: U1.T21 U1.O21 | U1.O21 66.32,25.87 U1.O21 | U2.T21 U2.O21
N$23
  Top 0.406: 80.29,27.14 75.21,27.14 73.94,28.41 U1.Q22 71.4,28.41 | 80.29,27.14 86.64,27.14 U4.P22 | U3.P22 80.29,27.14 | U2.P22 U2.T22 | U5.P22 5.36,27.14 29.49,27.14 30.76,28.41 U2.N22 U2.O22 | U2.O22 U2.T22 | U2.T22 U2.P22 | U2.P22 38.38,28.41 | 38.38,28.41 U2.Q22 40.92,28.41 42.19,27.14 62.51,27.14 63.78,28.41 U1.N22 U1.O22 U1.T22 | U2.T22 U2.O22 | U2.T22 38.38,28.41 | U1.T22 U1.P22 | U1.P22 71.4,28.41 | 71.4,28.41 U1.P22 | U1.T22 U1.P22
  Bottom 0.406: U1.T22 U1.P22 | U2.T22 U2.O22
N$24
  Top 0.406: 80.29,29.68 75.21,29.68 73.94,30.95 U1.Q23 71.4,30.95 U1.P23 | 80.29,29.68 86.64,29.68 U4.P23 | U3.P23 80.29,29.68 | U5.P23 5.36,29.68 29.49,29.68 30.76,30.95 U2.N23 U2.O23 U2.T23 U2.P23 U2.Q23 40.92,30.95 42.19,29.68 62.51,29.68 63.78,30.95 U1.N23 66.32,30.95 U1.O23 U1.T23 | U1.T23 U1.P23 | U1.P23 U1.T23
  Bottom 0.406: U1.T23 U1.P23 | U2.T23 U2.O23
N$25
  Top 0.406: 80.29,32.22 75.21,32.22 73.94,33.49 U1.Q24 71.4,33.49 U1.P24 U1.B24 | 80.29,32.22 86.64,32.22 U4.P24 | U3.P24 80.29,32.22 | U5.P24 5.36,32.22 29.49,32.22 30.76,33.49 U2.N24 33.3,33.49 U2.O24 U2.B24 U2.P24 U2.Q24 40.92,33.49 42.19,32.22 62.51,32.22 63.78,33.49 U1.N24 66.32,33.49 | U1.B24 U1.O24 66.32,33.49 | U1.B24 66.32,33.49
  Bottom 0.406: U1.B24 U1.P24 | U2.B24 U2.O24
N$26
  Top 0.406: 80.29,34.76 75.21,34.76 73.94,36.03 U1.Q25 71.4,36.03 U1.P25 U1.T25 U1.O25 66.32,36.03 U1.N25 63.78,36.03 62.51,34.76 42.19,34.76 40.92,36.03 U2.Q25 U2.P25 | 80.29,34.76 86.64,34.76 U4.P25 | U3.P25 80.29,34.76 | U2.P25 U2.T25 | U5.P25 5.36,34.76 29.49,34.76 30.76,36.03 U2.N25 U2.O25 U2.T25 | U2.T25 U2.P25
  Bottom 0.406: U1.T25 U1.P25 | U2.T25 U2.O25
N$27
  Top 0.406: 80.29,37.3 75.21,37.3 73.94,38.57 U1.Q26 | 80.29,37.3 86.64,37.3 U4.P26 | U3.P26 80.29,37.3 | U5.P26 5.36,37.3 29.49,37.3 30.76,38.57 U2.N26 U2.O26 U2.T26 U2.P26 U2.Q26 40.92,38.57 42.19,37.3 62.51,37.3 63.78,38.57 U1.N26 66.32,38.57 U1.O26 U1.T26 | U1.P26 71.4,38.57 | U1.Q26 71.4,38.57 | U1.Q26 71.4,38.57 | 71.4,38.57 U1.P26 | U1.P26 U1.T26 | U1.T26 U1.P26
  Bottom 0.406: U1.T26 U1.P26 | U2.T26 U2.O26
N$28
  Top 0.406: 80.29,39.84 75.21,39.84 73.94,41.11 U1.Q27 | 80.29,39.84 86.64,39.84 U4.P27 | U3.P27 80.29,39.84 | U5.P27 5.36,39.84 29.49,39.84 30.76,41.11 U2.N27 U2.O27 U2.B27 U2.P27 U2.Q27 40.92,41.11 42.19,39.84 62.51,39.84 63.78,41.11 U1.N27 66.32,41.11 U1.O27 | U1.P27 71.4,41.11 | U1.Q27 71.4,41.11 | U1.Q27 71.4,41.11 | 71.4,41.11 U1.P27 | U1.P27 U1.B27
  Bottom 0.406: U1.O27 U1.B27 U1.P27 | U2.B27 U2.O27
N$29
  Top 0.406: 80.29,42.38 75.21,42.38 73.94,43.65 U1.Q28 71.4,43.65 U1.P28 U1.B28 U1.O28 66.32,43.65 U1.N28 63.78,43.65 62.51,42.38 42.19,42.38 40.92,43.65 U2.Q28 U2.P28 U2.B28 U2.O28 U2.N28 30.76,43.65 29.49,42.38 5.36,42.38 U5.P28 | 80.29,42.38 86.64,42.38 U4.P28 | U3.P28 80.29,42.38
  Bottom 0.406: U1.B28 U1.O28 | U2.B28 U2.O28
N$30
  Top 0.406: 80.29,44.92 75.21,44.92 73.94,46.19 U1.Q29 71.4,46.19 U1.P29 U1.T29 U1.O29 66.32,46.19 U1.N29 63.78,46.19 62.51,44.92 42.19,44.92 40.92,46.19 U2.Q29 U2.P29 U2.T29 U2.O29 U2.N29 30.76,46.19 29.49,44.92 5.36,44.92 U5.P29 | 80.29,44.92 86.64,44.92 U4.P29 | U3.P29 80.29,44.92
  Bottom 0.406: U1.T29 U1.O29 | U2.T29 U2.O29
N$31
  Top 0.406: 80.29,47.46 75.21,47.46 73.94,48.73 U1.Q30 U1.P30 U1.B30 U1.O30 66.32,48.73 U1.N30 63.78,48.73 62.51,47.46 42.19,47.46 40.92,48.73 U2.Q30 U2.P30 U2.B30 U2.O30 U2.N30 30.76,48.73 29.49,47.46 5.36,47.46 U5.P30 | 80.29,47.46 86.64,47.46 U4.P30 | U3.P30 80.29,47.46
  Bottom 0.406: U1.B30 U1.O30 | U2.B30 U2.O30
N$32
  Top 0.406: 80.29,50 75.21,50 73.94,51.27 U1.Q31 71.4,51.27 U1.P31 U1.B31 U1.O31 66.32,51.27 U1.N31 63.78,51.27 62.51,50 42.19,50 40.92,51.27 U2.Q31 U2.P31 U2.B31 U2.O31 U2.N31 30.76,51.27 29.49,50 5.36,50 U5.P31 | 80.29,50 86.64,50 U4.P31 | U3.P31 80.29,50
  Bottom 0.406: U1.B31 U1.O31 | U2.B31 U2.O31
N$33
  Top 0.406: 80.29,52.54 75.21,52.54 73.94,53.81 U1.Q32 U1.P32 U1.B32 U1.O32 U1.N32 63.78,53.81 62.51,52.54 42.19,52.54 40.92,53.81 U2.Q32 U2.P32 U2.B32 U2.O32 U2.N32 30.76,53.81 29.49,52.54 5.36,52.54 U5.P32 | 80.29,52.54 86.64,52.54 U4.P32 | U3.P32 80.29,52.54
  Bottom 0.406: U1.B32 U1.O32 | U2.B32 U2.O32
N$34
  Top 0.406: 80.29,55.08 75.21,55.08 73.94,56.35 U1.Q33 71.4,56.35 U1.P33 U1.B33 U1.O33 66.32,56.35 U1.N33 63.78,56.35 62.51,55.08 42.19,55.08 40.92,56.35 U2.Q33 U2.P33 U2.B33 U2.O33 U2.N33 30.76,56.35 29.49,55.08 5.36,55.08 U5.P33 | 80.29,55.08 86.64,55.08 U4.P33 | U3.P33 80.29,55.08
  Bottom 0.406: U1.B33 U1.O33 | U2.B33 U2.O33
N$35
  Top 0.406: 80.29,57.62 75.21,57.62 73.94,58.89 U1.Q34 71.4,58.89 U1.P34 U1.T34 U1.O34 66.32,58.89 U1.N34 63.78,58.89 62.51,57.62 42.19,57.62 40.92,58.89 U2.Q34 U2.P34 U2.T34 U2.O34 U2.N34 30.76,58.89 29.49,57.62 5.36,57.62 U5.P34 | 80.29,57.62 86.64,57.62 U4.P34 | U3.P34 80.29,57.62
  Bottom 0.406: U1.T34 U1.O34 | U2.T34 U2.O34
N$36
  Top 0.406: 80.29,60.16 75.21,60.16 73.94,61.43 U1.Q35 U1.P35 U1.B35 U1.O35 66.32,61.43 U1.N35 63.78,61.43 62.51,60.16 42.19,60.16 40.92,61.43 U2.Q35 U2.P35 U2.B35 U2.O35 U2.N35 30.76,61.43 29.49,60.16 5.36,60.16 U5.P35 | 80.29,60.16 86.64,60.16 U4.P35 | U3.P35 80.29,60.16
  Bottom 0.406: U1.B35 U1.O35 | U2.B35 U2.O35
N$37
  Top 0.406: 80.29,62.7 75.21,62.7 73.94,63.97 U1.Q36 71.4,63.97 U1.P36 U1.T36 U1.O36 66.32,63.97 U1.N36 63.78,63.97 62.51,62.7 42.19,62.7 40.92,63.97 U2.Q36 U2.P36 U2.T36 U2.O36 U2.N36 30.76,63.97 29.49,62.7 5.36,62.7 U5.P36 | 80.29,62.7 86.64,62.7 U4.P36 | U3.P36 80.29,62.7
  Bottom 0.406: U1.T36 U1.O36 | U2.T36 U2.O36
N$38
  Top 0.406: 80.29,65.24 75.21,65.24 73.94,66.51 U1.Q37 71.4,66.51 U1.P37 U1.T37 U1.O37 66.32,66.51 U1.N37 63.78,66.51 62.51,65.24 42.19,65.24 40.92,66.51 U2.Q37 U2.P37 U2.T37 U2.O37 U2.N37 30.76,66.51 29.49,65.24 5.36,65.24 U5.P37 | 80.29,65.24 86.64,65.24 U4.P37 | U3.P37 80.29,65.24
  Bottom 0.406: U1.T37 U1.O37 | U2.T37 U2.O37
N$39
  Top 0.406: 80.29,67.78 75.21,67.78 73.94,69.05 U1.Q38 U1.P38 | 80.29,67.78 86.64,67.78 U4.P38 | U3.P38 80.29,67.78 | U5.P38 5.36,67.78 29.49,67.78 30.76,69.05 U2.N38 U2.O38 U2.B38 U2.P38 U2.Q38 40.92,69.05 42.19,67.78 62.51,67.78 63.78,69.05 U1.N38 U1.O38 U1.B38 | U1.P38 U1.B38 | U1.P38 U1.B38
  Bottom 0.406: U1.B38 U1.O38 | U2.B38 U2.O38
N$40
  Top 0.406: 80.29,70.32 75.21,70.32 73.94,71.59 U1.Q39 71.4,71.59 U1.P39 | 80.29,70.32 86.64,70.32 U4.P39 | U3.P39 80.29,70.32 | U5.P39 5.36,70.32 29.49,70.32 30.76,71.59 U2.N39 U2.O39 U2.B39 U2.P39 U2.Q39 40.92,71.59 42.19,70.32 62.51,70.32 63.78,71.59 U1.N39 66.32,71.59 | 66.32,71.59 U1.O39 | U1.O39 U1.B39 | U1.B39 U1.P39 | U1.O39 66.32,71.59 | U1.P39 U1.B39
  Bottom 0.406: U1.B39 U1.O39 | U2.B39 U2.O39
N$41
  Top 0.406: 80.29,72.86 75.21,72.86 73.94,74.13 U1.Q40 71.4,74.13 U1.P40 U1.T40 U1.O40 66.32,74.13 U1.N40 63.78,74.13 62.51,72.86 42.19,72.86 40.92,74.13 U2.Q40 U2.P40 U2.T40 U2.O40 U2.N40 30.76,74.13 29.49,72.86 5.36,72.86 U5.P40 | 80.29,72.86 86.64,72.86 U4.P40 | U3.P40 80.29,72.86
  Bottom 0.406: U1.T40 U1.O40 | U2.T40 U2.O40
N$42
  Bottom 1.778: X2.P2 X1.P2 X3.P2
N$43
  Bottom 1.778: X2.P3 X1.P3 X3.P3
N$44
  Bottom 1.778: X3.P4 X1.P4 X2.P4
N$45
  Bottom 1.778: X2.P5 X1.P5 X3.P5
N$46
  Bottom 1.778: X2.P6 X1.P6 X3.P6
N$47
  Bottom 1.778: X2.P7 X1.P7 X3.P7
N$48
  Bottom 1.778: X2.P8 X1.P8 X3.P8
N$49
  Bottom 1.778: X2.P9 X1.P9 X3.P9
N$50
  Bottom 1.778: X2.P10 X1.P10 X3.P10
N$51
  Bottom 1.778: X2.P11 X1.P11 X3.P11
N$52
  Bottom 1.778: X2.P12 X1.P12 X3.P12
N$53
  Bottom 1.778: X2.P13 X1.P13 X3.P13
N$54
  Bottom 1.778: X5.P1 X4.P1 X6.P1
N$55
  Bottom 1.778: X5.P2 X4.P2 X6.P2
N$56
  Bottom 1.778: X5.P3 X4.P3 X6.P3
N$57
  Bottom 1.778: X5.P4 X4.P4 X6.P4
N$58
  Bottom 1.778: X5.P5 X4.P5 X6.P5
N$59
  Bottom 1.778: X5.P6 X4.P6 X6.P6
N$60
  Bottom 1.778: X5.P7 X4.P7 X6.P7
N$61
  Bottom 1.778: X5.P8 X4.P8 X6.P8
N$62
  Bottom 1.778: X5.P9 X4.P9 X6.P9
N$63
  Bottom 1.778: X5.P10 X4.P10 X6.P10
N$64
  Bottom 1.778: X5.P11 X4.P11 X6.P11
N$65
  Bottom 1.778: X5.P12 X4.P12 X6.P12
N$66
  Bottom 1.778: X5.P13 X4.P13 X6.P13
(copper drawn outside any net)
  shapes: Top circle x3

### Text on the board
tNames: LAMLOEI A092508 | 20220515 | LAMLOEI | A092508 | 1 | 40 | 2 | 39 | 3 | 38 | 4 | 37 | 5 | 36 | 6 | 35 | 7 | 34 | 8 | 33 | 9 | 32 | 10 | 31 | 11 | 30 | 12 | 29 | 13 | 28 | 14 | 27 | 15 | 26 | 16 | 25 | 17 | 24 | 18 | 23 | 19 | 22 | 20 | 21 | LAMLOEI A092508 | 20220515
bNames: A092508 | LAMLOEI | 40 | 1 | 39 | 2 | 38 | 3 | 37 | 4 | 36 | 5 | 35 | 6 | 34 | 7 | 33 | 8 | 32 | 9 | 31 | 10 | 30 | 11 | 29 | 12 | 28 | 13 | 27 | 14 | 26 | 15 | 25 | 16 | 24 | 17 | 23 | 18 | 22 | 19 | 21 | 20
tDocu: X6 | X4 | X5 | U5 | U3 | U4 | U2 | U1 | J1 | X2 | J2 | X1 | J3 | J4 | X3